# EAGLE design eCog100_ESP8266_Wifi (EAGLE 6.6.0)
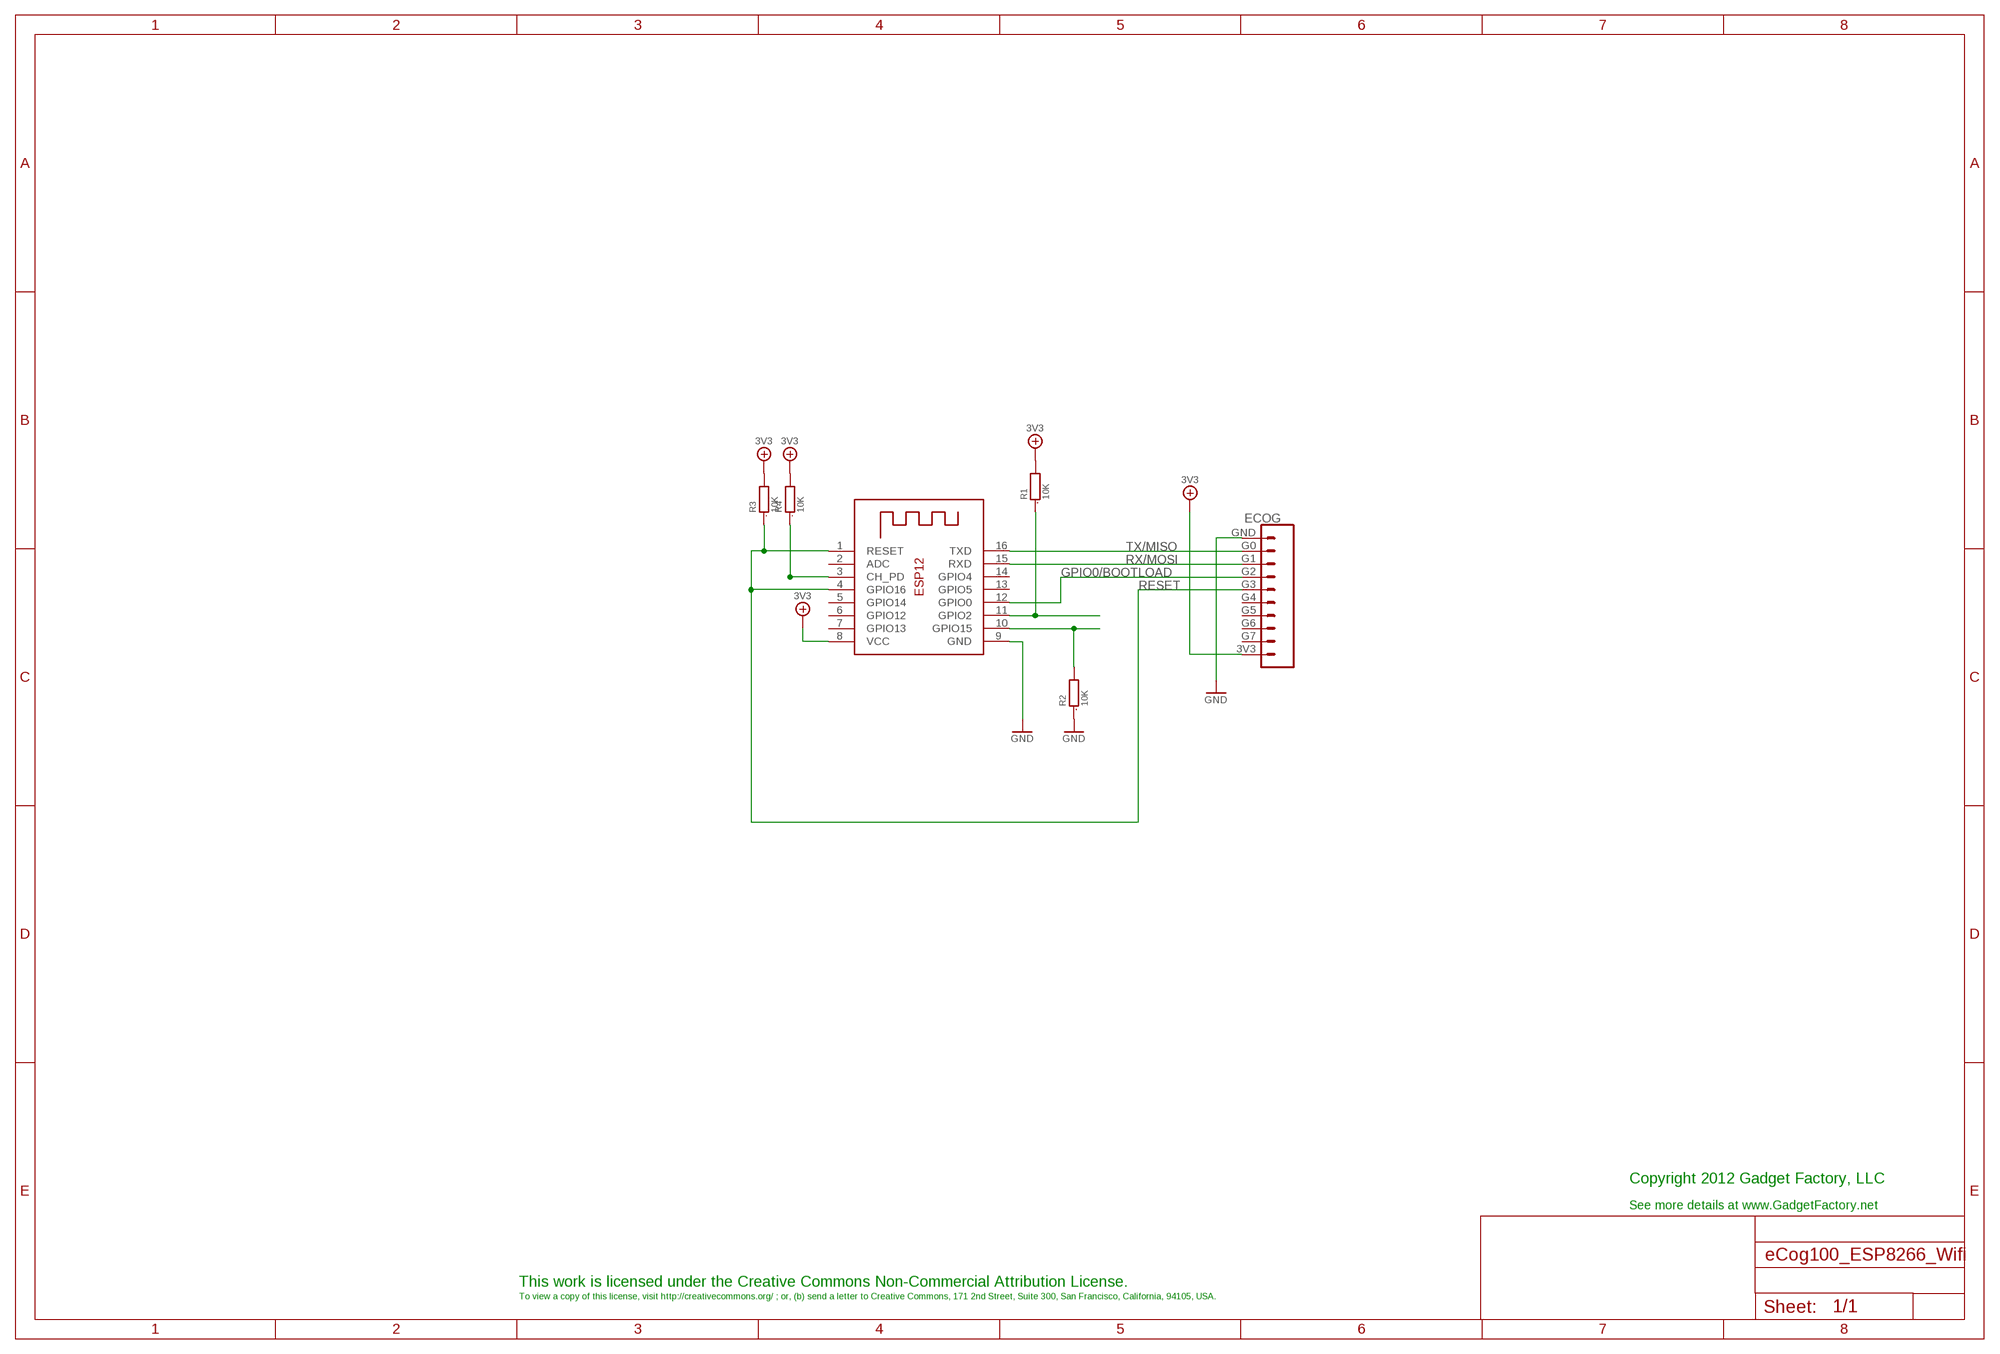
[diagram p0: schematic, sheet 1]

## Parts
ECOG  ECOG_GENERAL_ROWSURFACEMOUNT  [ECOG_GENERAL_SMD]
R1  10K  R0805  [0805]
R2  10K  R0805  [0805]
R3  10K  R0805  [0805]
R4  10K  R0805  [0805]
X1  ESP-12  [ESP-12]

## Nets
3V3: ECOG.3V3 R1.2 R3.2 R4.2 X1.8(VCC)
GND: ECOG.GND R2.1 X1.9(GND)
GPIO0/BOOTLOAD: ECOG.G2 X1.12(GPIO0)
N$3: R1.1 X1.11(GPIO2)
N$4: R2.2 X1.10(GPIO15)
N$5: R4.1 X1.3(CH_PD)
RESET: ECOG.G3 R3.1 X1.1(RESET) X1.4(GPIO16)
RX/MOSI: ECOG.G1 X1.15(RXD)
TX/MISO: ECOG.G0 X1.16(TXD)
Unconnected: ECOG.G4 ECOG.G5 ECOG.G6 ECOG.G7 X1.2(ADC) X1.5(GPIO14) X1.6(GPIO12) X1.7(GPIO13) X1.13(GPIO5) X1.14(GPIO4)

## Notes on the sheet
- Copyright 2012 Gadget Factory, LLC
- See more details at www.GadgetFactory.net
- This work is licensed under the Creative Commons Non-Commercial Attribution License.
- To view a copy of this license, visit http://creativecommons.org/ ; or, (b) send a letter to Creative Commons, 171 2nd Street, Suite 300, San Francisco, California, 94105, USA.

## Library data of the parts
ECOG = eCogs:ECOG_GENERAL_ROW; DIGIKEY: S1013EC-10-ND
R1-R4 = GadgetFactory:R: RESISTOR, European symbol; DIGIKEY: RMCF0805JT10K0CT-ND
X1 = adafruit:ESP-12; ADAFRUIT: 2491

## Board
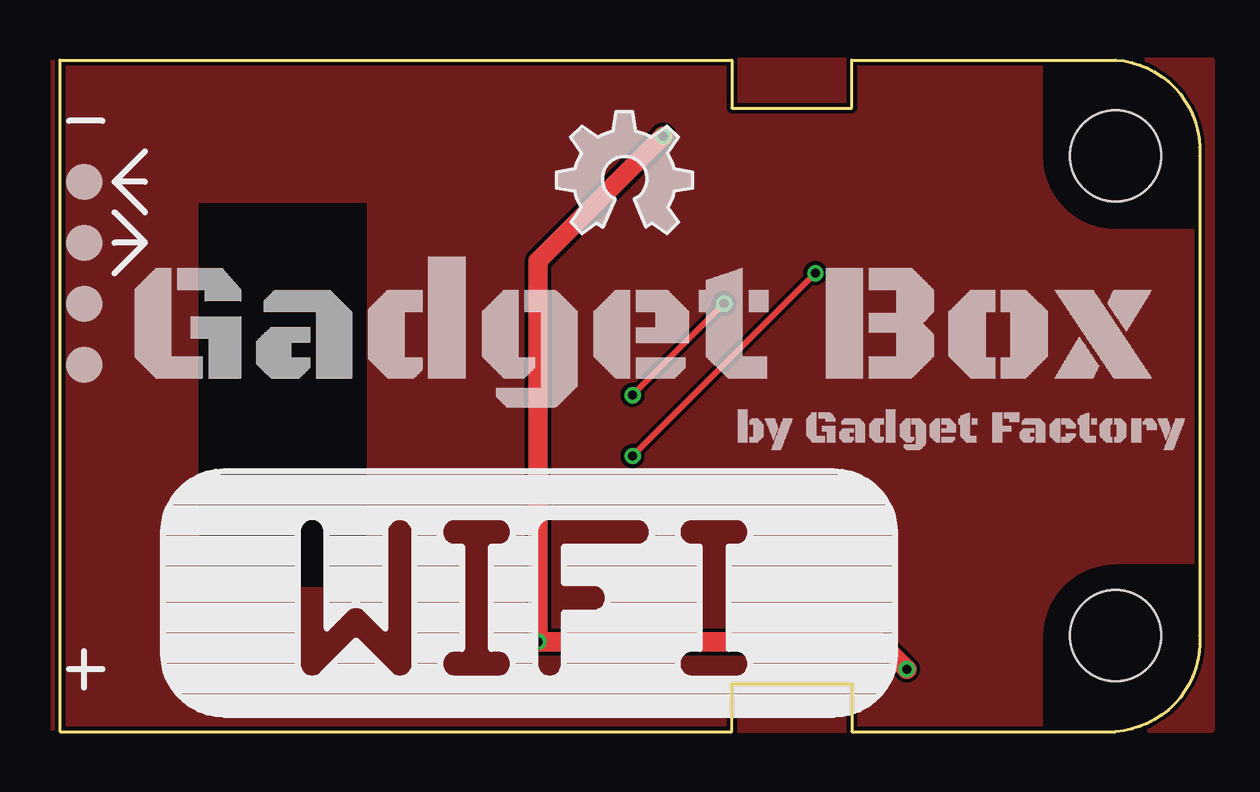
[diagram p1: board, top side]
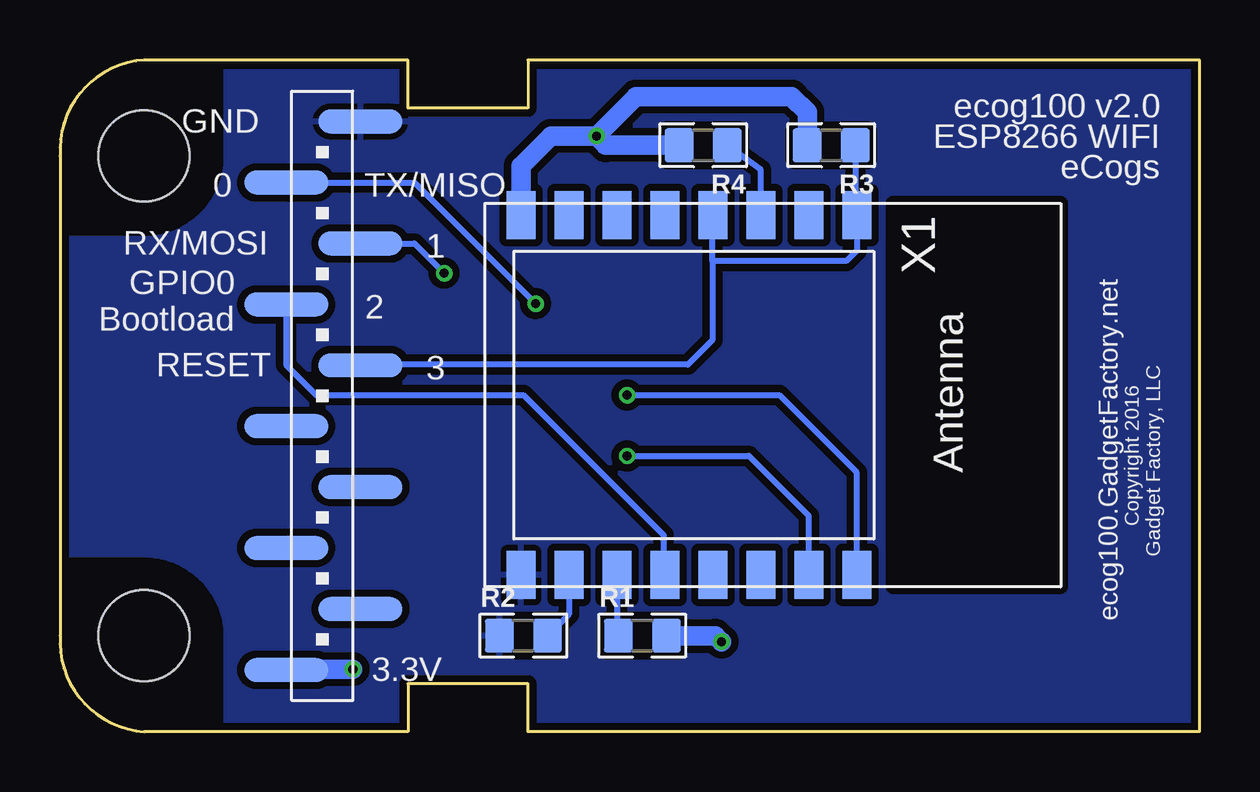
[diagram p2: board, bottom side, seen from below]

Size 47.51 x 28 mm. Coordinates in mm from the lower left corner, seen from the top.
Copper layers (1*16): Top 0.035mm / dielectric 1.5mm / Bottom 0.035mm
Design rules "hackvana": minimum track width 6mil, minimum drill 0.3mm, track to track 6mil, track to pad 6mil, pad to pad 6mil, via to via 6mil, smd to smd 0mil, copper to edge 6mil, drill to drill 6mil, minimum pad ring 10mil, minimum via ring 6mil, stop-mask expansion 2mil, vias tented up to drill 100mil, thermal gap 10mil

### Footprints (pad centres in the part's own frame; a part is rotated, then mirrored left to right if it is on the bottom)
ECOG_GENERAL_SMD = smd 3.5 x 1 bottom: 3V3 9.923,25.429; G0 9.923,5.111; G1 13.022,7.649; G2 9.923,10.189; G3 13.022,12.729; G4 9.923,15.269; G5 13.022,17.809; G6 9.923,20.349; G7 13.022,22.889; GND 13.022,2.571 | hole 3.8: 4,24; 4,4
0805 = smd 1.2 x 1.4: 1 -1,0; 2 1,0
ESP-12 = smd 2 x 1.2: 1 -7.5,4.5; 2 -7.5,2.5; 3 -7.5,0.5; 4 -7.5,-1.5; 5 -7.5,-3.5; 6 -7.5,-5.5; 7 -7.5,-7.5; 8 -7.5,-9.5; 9 7.5,-9.5; 10 7.5,-7.5; 11 7.5,-5.5; 12 7.5,-3.5; 13 7.5,-1.5; 14 7.5,0.5; 15 7.5,2.5; 16 7.5,4.5

### Placement (x,y rotation side)
ECOG  ECOG_GENERAL_ROWECOG_GENERAL_SMD  [ECOG_GENERAL_SMD]  48,28 180 top
R1  23.24,4 0 bottom
R2  28.19,4 0 bottom
R3  15.36,24.44 180 bottom
R4  20.7,24.44 180 bottom
U$1  [GADGETBOX_TEXT]  24.38,16.44 0 top
U$2  [LEGEND_DIO]  1.01,15.3 180 top
U$3  [LEGEND_DIO]  1.01,17.84 180 top
U$4  [LEGEND_DIO]  1.01,20.38 180 top
U$5  [LEGEND_DIO]  1.01,22.92 180 top
U$6  [OSHW_FILLX200_NOTEXT]  20.7,20.76 0 top
X1  18.79,14.03 270 bottom

### Tracks (layer width: path | path; a pad name or v marks a point on that pad's centre or on a via)
3V3  (via drill 0.38)
  Top 0.813: v25.14,24.82 19.93,19.62 v19.93,3.74 34.16,3.74 v35.3,2.6
  Bottom 0.813: 28.38,21.62 X1.8 28.29,23.58 27.05,24.82 v25.14,24.82 | R4.2 24.76,24.44 v25.14,24.82 | R3.2 16.36,25.82 17.01,26.48 23.49,26.48 v25.14,24.82 | R1.2 20.19,4 v19.93,3.74 | v35.3,2.6 38.05,2.6 ECOG.3V3
GND
  pour Bottom (isolate 0.305): 48,0 0,0 0,28 48,28
  pour Top: 48,0.06 -0.26,0.06 -0.26,28 48,28
GPIO0/BOOTLOAD
  Bottom 0.254: X1.12 22.35,6.59 22.35,8.19 28.19,14.03 36.82,14.03 38.08,15.28 ECOG.G2
N$3
  Bottom 0.254: X1.11 24.29,4.05 R1.1
N$4
  Bottom 0.254: X1.10 26.29,4.89 R2.2
N$5
  Bottom 0.254: X1.3 18.29,23.42 R4.1
RESET
  Bottom 0.254: 20.31,19.62 20.31,21.51 X1.4 | R3.1 14.36,21.6 X1.1 14.29,20.05 14.73,19.62 20.31,19.62 | 20.31,19.62 20.31,16.32 21.33,15.3 34.95,15.3 ECOG.G3
RX/MOSI  (via drill 0.38)
  Top 0.254: v31.49,19.11 v23.87,11.49
  Bottom 0.254: 16.25,6.49 X1.15 16.29,8.99 18.79,11.49 v23.87,11.49 | ECOG.G1 32.73,20.35 v31.49,19.11
TX/MISO  (via drill 0.38)
  Top 0.254: v27.68,17.84 v23.87,14.03
  Bottom 0.254: 14.47,6.35 X1.16 14.29,10.8 17.52,14.03 v23.87,14.03 | ECOG.G0 32.73,22.89 v27.68,17.84

### Text on the board
bPlace: ecog100 v2.0 | GND | ESP8266 WIFI | eCogs | TX/MISO | 0 | 1 | RX/MOSI | GPIO0 / Bootload | 2 | 3 | RESET | Copyright 2016 | Gadget Factory, LLC | ecog100.GadgetFactory.net | 3.3V